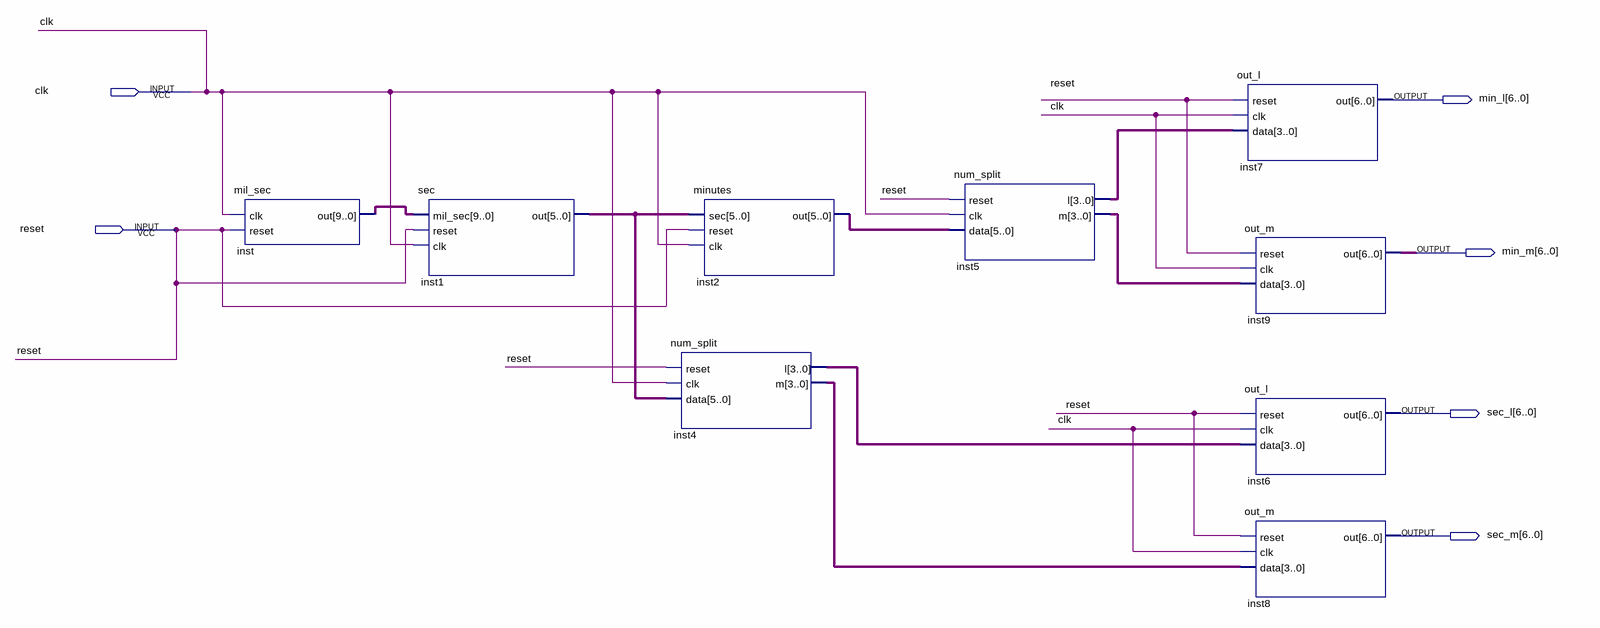
[diagram p0: schematic sheet]
// Quartus schematic Block1.bdf as structural Verilog: 9 symbols, 6 pins
module Block1 (
  input  clk,
  input  reset,
  output [6:0] min_l,
  output [6:0] min_m,
  output [6:0] sec_l,
  output [6:0] sec_m
);

  wire [3:0] inst4_l, inst4_m, inst5_l, inst5_m;
  wire [5:0] inst1_out, inst2_out;
  wire [9:0] inst_out;

  mil_sec inst (.clk(clk), .reset(reset), .out(inst_out));
  sec inst1 (.mil_sec(inst_out), .reset(reset), .clk(clk), .out(inst1_out));
  minutes inst2 (.sec(inst1_out), .reset(reset), .clk(clk), .out(inst2_out));
  num_split inst4 (.reset(reset), .clk(clk), .data(inst1_out), .l(inst4_l), .m(inst4_m));
  num_split inst5 (.reset(reset), .clk(clk), .data(inst2_out), .l(inst5_l), .m(inst5_m));
  out_l inst7 (.reset(reset), .clk(clk), .data(inst5_l), .out(min_l));
  out_m inst9 (.reset(reset), .clk(clk), .data(inst5_m), .out(min_m));
  out_l inst6 (.reset(reset), .clk(clk), .data(inst4_l), .out(sec_l));
  out_m inst8 (.reset(reset), .clk(clk), .data(inst4_m), .out(sec_m));
endmodule
